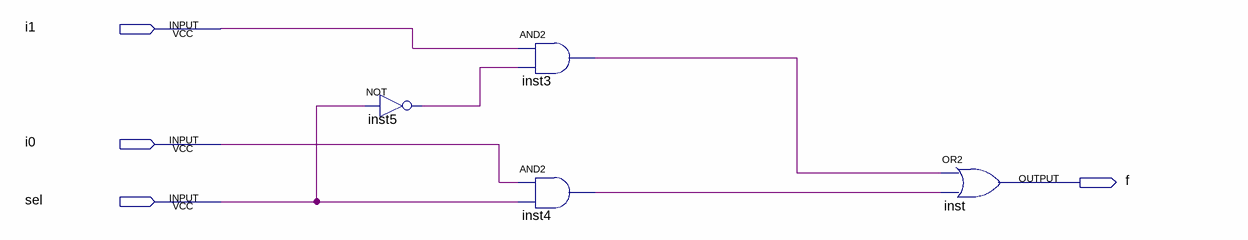
[diagram p0: schematic sheet]
// Quartus schematic MuxDemo.bdf as structural Verilog: 4 symbols, 4 pins
module MuxDemo (
  input  i1,
  input  i0,
  input  sel,
  output f
);

  wire inst3_out, inst4_out, inst5_out;

  not inst5 (inst5_out, sel);
  and inst3 (inst3_out, i1, inst5_out);
  and inst4 (inst4_out, i0, sel);
  or inst (f, inst3_out, inst4_out);
endmodule
